# Altium project RCD300.PrjPcb
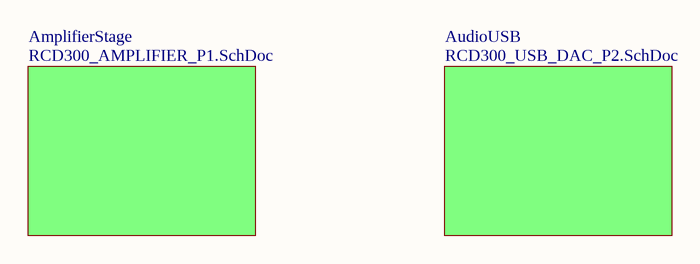
[diagram p0: RCD300_P0.SchDoc]
3 sheets, 46 parts. Net scope: global (net labels, ports and power ports of the same name join across sheets).
Sheets:
  RCD300_P0.SchDoc
    AmplifierStage = RCD300_AMPLIFIER_P1.SchDoc
    AudioUSB = RCD300_USB_DAC_P2.SchDoc

## Sheet RCD300_P0.SchDoc
size A4

### Sub-sheets
AmplifierStage = RCD300_AMPLIFIER_P1.SchDoc: no entries
AudioUSB = RCD300_USB_DAC_P2.SchDoc: no entries

## Sheet RCD300_AMPLIFIER_P1.SchDoc
size A4
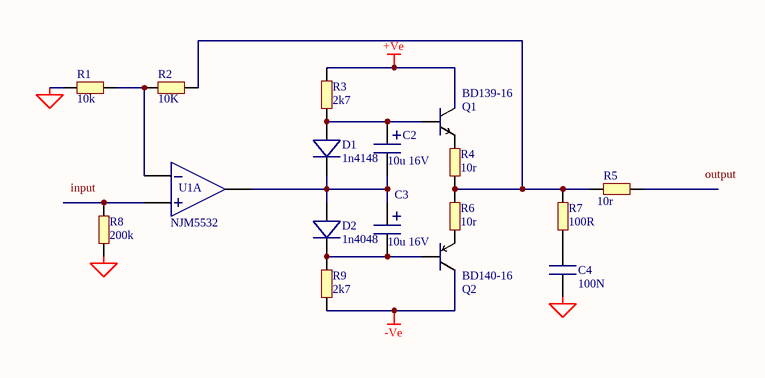
[diagram p1: RCD300_AMPLIFIER_P1.SchDoc]

### Parts
C2  10u 16V  [CAP CASE B]
C3  10u 16V  [CAP CASE B]
C4  100N  [CAP 0805]
D1  1n4148  [SOT-23]
D2  1n4048  [SOT-23]
Q1  BD139-16  [TO-126-V]
Q2  BD140-16  [TO-126-V]
R1  10k  [RES 0805]
R2  10K  [RES 0805]
R3  2k7  [RES 0805]
R4  10r  [RES 1206]
R5  10r  [RES 1206]
R6  10r  [RES 1206]
R7  100R  [RES 0805]
R8  200k  [RES 0805]
R9  2k7  [RES 0805]
U1  NJM5532  [DIP-8 SOCKETED]  (part A of 3)

### Nets
+Ve: Q1.2(C) R3.2
-Ve: Q2.2(C) R9.1
SGND: C4.1 R1.1 R8.1
NetC2_1: C2.1 D1.1(A) Q1.3(B) R3.1
NetC2_2: C2.2 C3.1 D1.3(C) D2.1(A) U1.1(OUTPUT)
NetC3_2: C3.2 D2.3(C) Q2.3(B) R9.2
NetC4_2: C4.2 R7.1
NetQ1_1: Q1.1(E) R4.1
NetQ2_1: Q2.1(E) R6.2
NetR1_2: R1.2 R2.1 U1.2(INV)
NetR2_2: R2.2 R4.2 R5.1 R6.1 R7.2
NetR8_2: R8.2 U1.3(NONINV)

Not connected (* = marked no-connect by the designer): R5 2

### Notes on the sheet
- Labels drawn without touching a wire or pin: input, output

### Library data of the parts
C2 C3 = 10u 16V: Standard Case B Electrolytic Capacitor; Type: Al; Voltage: 16; UA P/N: 16-0026; Value: 10u 16V
C4 = 100N: Standard 0805 Capacitor; Type: X7R; Voltage: 50V; UA P/N: 16-0001; Value: 100N; Footprint: 0805
D1 D2 = BAS21: SOT23 Diode; Value: BAS21; Type: SIG DIODE; UA P/N: 15-0007
Q1 = BD139-16: NPN TO126 Transistor; Type: BD139; Value: BD139-16; Farnell PN: 108-4508
Q2 = BD140-16: PNP TO126 Transistor; Type: BD140; Value: BD140-16; Farnell PN: 108-4566
R1 = 3k9: Standard 0805 Resistor; Value: 3K9; UA P/N: 13-0053; Footprint: 0805; Type: THICK FILM
R2 = 10K: Standard 0805 Resistor; UA P/N: 13-0007; Value: 10K; Footprint: 0805; Type: THICK FILM
R3 R9 = 4K7: Standard 0805 Resistor; Value: 4K7; UA P/N: 13-0060; Footprint: 0805; Type: THICK FILM
R4-R6 = 1206 4R7: Standard 1206 Resistor; UA P/N: 13-0083; Value: 1206 4R7; Footprint: 1206; Type: Thick Film
R7 = 100R: Standard 0805 Resistor; UA P/N: 13-0004; Value: 100R; Footprint: 0805; Type: THICK FILM
R8 = 100K: Standard 0805 Resistor; Value: 100K; UA P/N: 13-0002; Footprint: 0805; Type: THICK FILM
U1 = NJM5532: Dual OPAMP DIP8 socketed; UA P/N: 15-1046; Value: NJM5532; Type: BIPOLAR OP-AMP DUAL

## Sheet RCD300_USB_DAC_P2.SchDoc
size A4
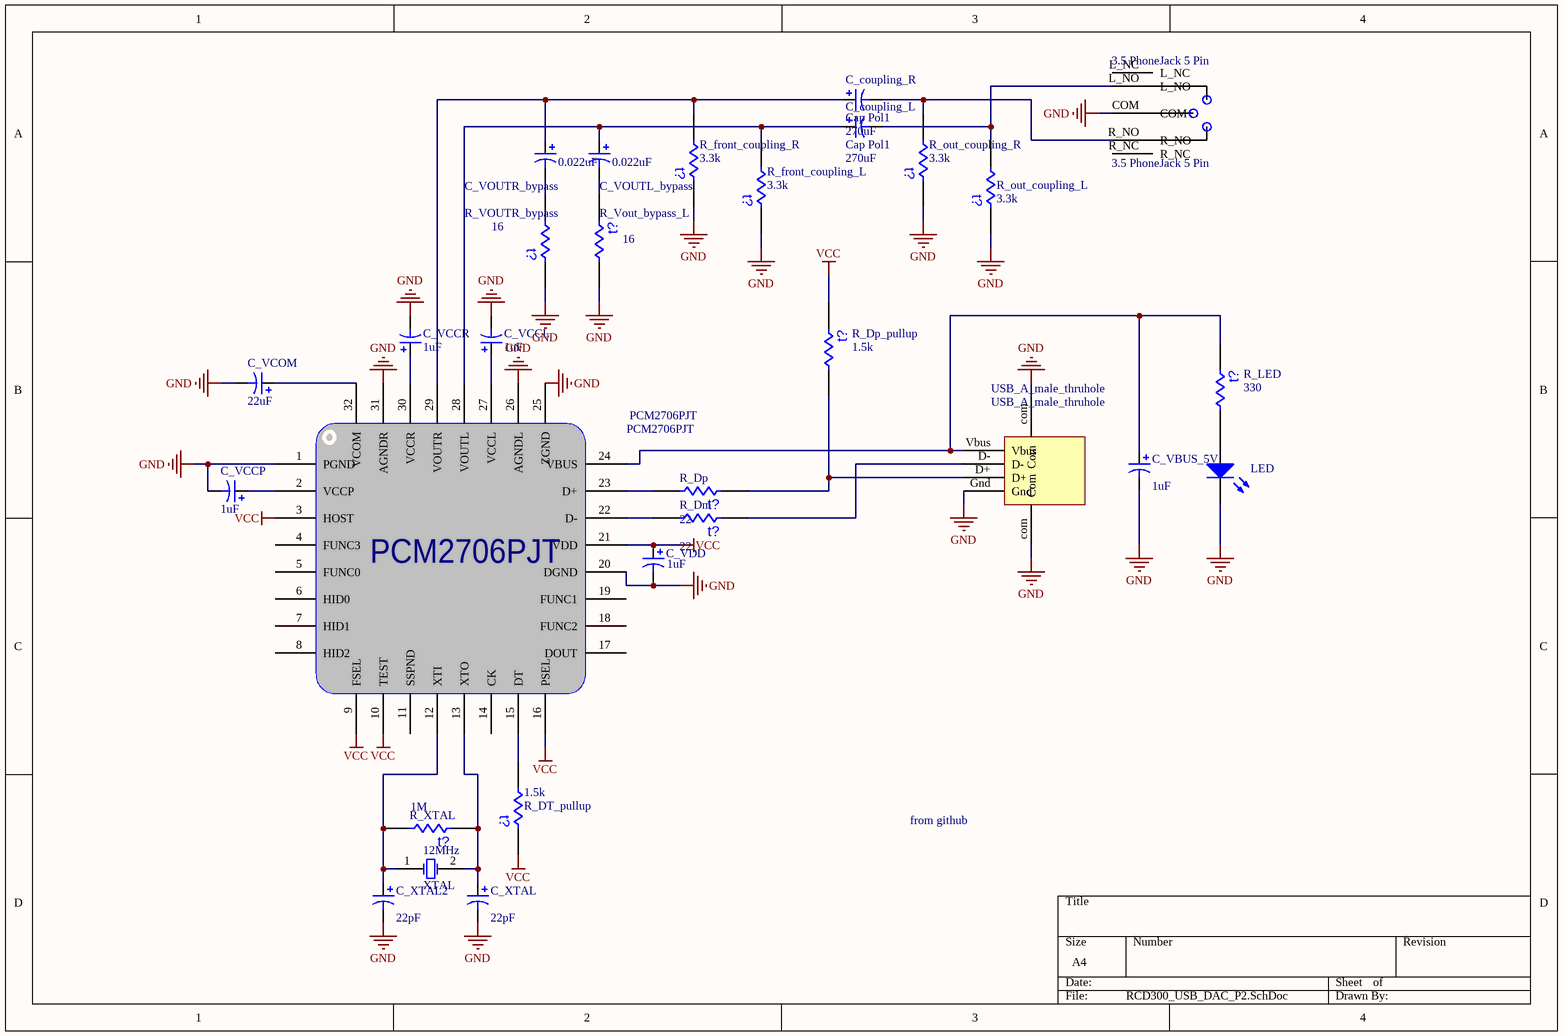
[diagram p2: RCD300_USB_DAC_P2.SchDoc]

### Parts
1.5k  R_DT_pullup  [6-0805_N]
3.5_PhoneJack_5_Pin  3.5 PhoneJack 5 Pin  [3.5 PhoneJack 5 Pin]
12MHz  XTAL  [12MHz Crystal OSC through hole]
C_coupling_L  Cap Pol1  value 270uF  [CAP_270uf_16V_solid_Aluminum]
C_coupling_R  Cap Pol1  value 270uF  [CAP_270uf_16V_solid_Aluminum]
C_VBUS_5V  value 1uF  [C0805]
C_VCCL  value 1uF  [C0805]
C_VCCP  value 1uF  [C0805]
C_VCCR  value 1uF  [C0805]
C_VCOM  value 22uF  [CAPC3216N]
C_VDD  value 1uF  [C0805]
C_VOUTL_bypass  value 0.022uF  [C0805]
C_VOUTR_bypass  value 0.022uF  [C0805]
C_XTAL  value 22pF  [C0805]
C_XTAL2  value 22pF  [C0805]
LED  (no value)  [CAPC1608N]
PCM2706PJT  PCM2706PJT  [S-PQFP-N32-2mm-out]
R_Dm  22  [6-0805_N]
R_Dp  22  [6-0805_N]
R_Dp_pullup  1.5k  [6-0805_N]
R_front_coupling_L  3.3k  [6-0805_N]
R_front_coupling_R  3.3k  [6-0805_N]
R_LED  330  [6-0805_N]
R_out_coupling_L  3.3k  [6-0805_N]
R_out_coupling_R  3.3k  [6-0805_N]
R_Vout_bypass_L  16  [6-0805_N]
R_VOUTR_bypass  16  [6-0805_N]
R_XTAL  1M  [6-0805_N]
USB_A_male_thruhole  USB_A_male_thruhole  [USB_A_male_thruhole]

### Nets
GND: 3.5_PhoneJack_5_Pin.COM C_VBUS_5V.2 C_VCCL.2 C_VCCP.2 C_VCCR.2 C_VCOM.2 C_VDD.2 C_XTAL.2 C_XTAL2.2 LED.2(K) PCM2706PJT.1(PGND) PCM2706PJT.20(DGND) PCM2706PJT.25(ZGND) PCM2706PJT.26(AGNDL) PCM2706PJT.31(AGNDR) R_front_coupling_L.1 R_front_coupling_R.1 R_out_coupling_L.1 R_out_coupling_R.1 R_Vout_bypass_L.2 R_VOUTR_bypass.1 USB_A_male_thruhole.com(Com) USB_A_male_thruhole.Gnd
VCC: 1.5k.1 C_VDD.1 PCM2706PJT.3(HOST) PCM2706PJT.9(FSEL) PCM2706PJT.10(TEST) PCM2706PJT.16(PSEL) PCM2706PJT.21(VDD) R_Dp_pullup.1
Net1.5k_2: 1.5k.2 PCM2706PJT.15(DT)
Net3.5_PhoneJack_5_Pin_L_NO: 3.5_PhoneJack_5_Pin.L_NO C_coupling_L.2 R_out_coupling_L.2
Net3.5_PhoneJack_5_Pin_R_NO: 3.5_PhoneJack_5_Pin.R_NO C_coupling_R.2 R_out_coupling_R.2
Net12MHz_1: 12MHz.1(OSC1) C_XTAL2.1 PCM2706PJT.12(XTI) R_XTAL.2
Net12MHz_2: 12MHz.2(OSC2) C_XTAL.1 PCM2706PJT.13(XTO) R_XTAL.1
NetC_coupling_L_1: C_coupling_L.1 C_VOUTL_bypass.1 PCM2706PJT.28(VOUTL) R_front_coupling_L.2
NetC_coupling_R_1: C_coupling_R.1 C_VOUTR_bypass.1 PCM2706PJT.29(VOUTR) R_front_coupling_R.2
NetC_VBUS_5V_1: C_VBUS_5V.1 PCM2706PJT.24(VBUS) R_LED.1 USB_A_male_thruhole.Vbus
NetC_VCCL_1: C_VCCL.1 PCM2706PJT.27(VCCL)
NetC_VCCP_1: C_VCCP.1 PCM2706PJT.2(VCCP)
NetC_VCCR_1: C_VCCR.1 PCM2706PJT.30(VCCR)
NetC_VCOM_1: C_VCOM.1 PCM2706PJT.32(VCOM)
NetC_VOUTL_bypass_2: C_VOUTL_bypass.2 R_Vout_bypass_L.1
NetC_VOUTR_bypass_2: C_VOUTR_bypass.2 R_VOUTR_bypass.2
NetLED_1: LED.1(A) R_LED.2
NetPCM2706PJT_22: PCM2706PJT.22(D-) R_Dm.2
NetPCM2706PJT_23: PCM2706PJT.23(D+) R_Dp.2
NetR_Dm_1: R_Dm.1 USB_A_male_thruhole.D-
NetR_Dp_1: R_Dp.1 R_Dp_pullup.2 USB_A_male_thruhole.D+

Not connected (* = marked no-connect by the designer): 3.5_PhoneJack_5_Pin L_NC R_NC; PCM2706PJT 4(FUNC3) 5(FUNC0) 6(HID0) 7(HID1) 8(HID2) 11(SSPND) 14(CK) 17(DOUT) 18(FUNC2) 19(FUNC1)

### Notes on the sheet
- from github
- (in symbol Res Thermal) t?

### Library data of the parts
1.5k R_Dm R_Dp R_Dp_pullup R_front_coupling_L R_front_coupling_R R_LED R_out_coupling_L R_out_coupling_R R_Vout_bypass_L R_VOUTR_bypass R_XTAL = Res Thermal: Thermistor; Published: 24-Mar-1999; LatestRevisionDate: 29-May-2009; LatestRevisionNote: IPC-7351 Footprint Added.; PackageVersion: Mar-2003; PackageReference: 6-0805; Publisher: Altium Limited; PackageDescription: Chip Resistor 0805 Case Size; Code_IPC: RESC2012
12MHz = XTAL: Crystal Oscillator; Published: 8-Jun-2000; LatestRevisionDate: 17-Jul-2002; LatestRevisionNote: Re-released for DXP Platform.; PackageReference: R38; Publisher: Altium Limited; PackageDescription: Crystal, Thru-Hole; 2 Leads; Body 3.1 x 8.2 mm (Dia.xH)
C_coupling_L C_coupling_R = Cap Pol1: Polarized Capacitor (Radial); Published: 8-Jun-2000; LatestRevisionDate: 17-Jul-2002; LatestRevisionNote: Re-released for DXP Platform.; PackageReference: RB7.6-15; Publisher: Altium Limited; PackageDescription: Polarized Capacitor (Radial); 2 Leads
C_VBUS_5V C_VCCL C_VCCP C_VCCR C_VCOM C_VDD C_VOUTL_bypass C_VOUTR_bypass C_XTAL C_XTAL2 = Cap Pol3: Polarized Capacitor (Surface Mount); Published: 8-Jun-2000; LatestRevisionDate: 29-May-2009; LatestRevisionNote: IPC-7351 Footprint Added.; PackageReference: C0805; Publisher: Altium Limited; PackageDescription: Chip Capacitor
LED = LED2: Typical RED, GREEN, YELLOW, AMBER GaAs LED; Published: 8-Jun-2000; LatestRevisionDate: 17-Jul-2002; LatestRevisionNote: Re-released for DXP Platform.; PackageVersion: Feb-2002; PackageReference: 3.2X1.6X1.1; Publisher: Altium Limited; PackageDescription: SM LED; 2 Flat Leads